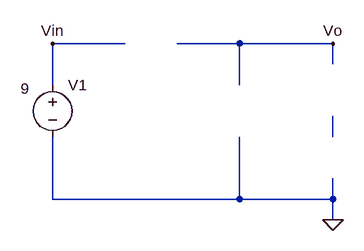
[diagram p0: schematic diode_circuit.asc]
diode_circuit.asc, the LTspice schematic file:
Version 4
SHEET 1 880 680
WIRE -544 -64 -656 -64
WIRE -368 -64 -464 -64
WIRE -224 -64 -368 -64
WIRE -224 -32 -224 -64
WIRE -656 0 -656 -64
WIRE -368 0 -368 -64
WIRE -224 80 -224 48
WIRE -656 176 -656 80
WIRE -368 176 -368 80
WIRE -368 176 -656 176
WIRE -224 176 -224 144
WIRE -224 176 -368 176
WIRE -224 208 -224 176
FLAG -224 208 0
FLAG -224 -64 Vo
FLAG -656 -64 Vin
SYMBOL voltage -656 -16 R0
WINDOW 3 -49 21 Left 2
WINDOW 123 0 0 Left 2
WINDOW 39 -153 12 Left 2
SYMATTR Value 9
SYMATTR InstName V1

The netlist it stands for:
* diode_circuit.asc
V1 Vin 0 9
.backanno
.end